# EAGLE design led_dual_supply_REV_2a (EAGLE 5.07)
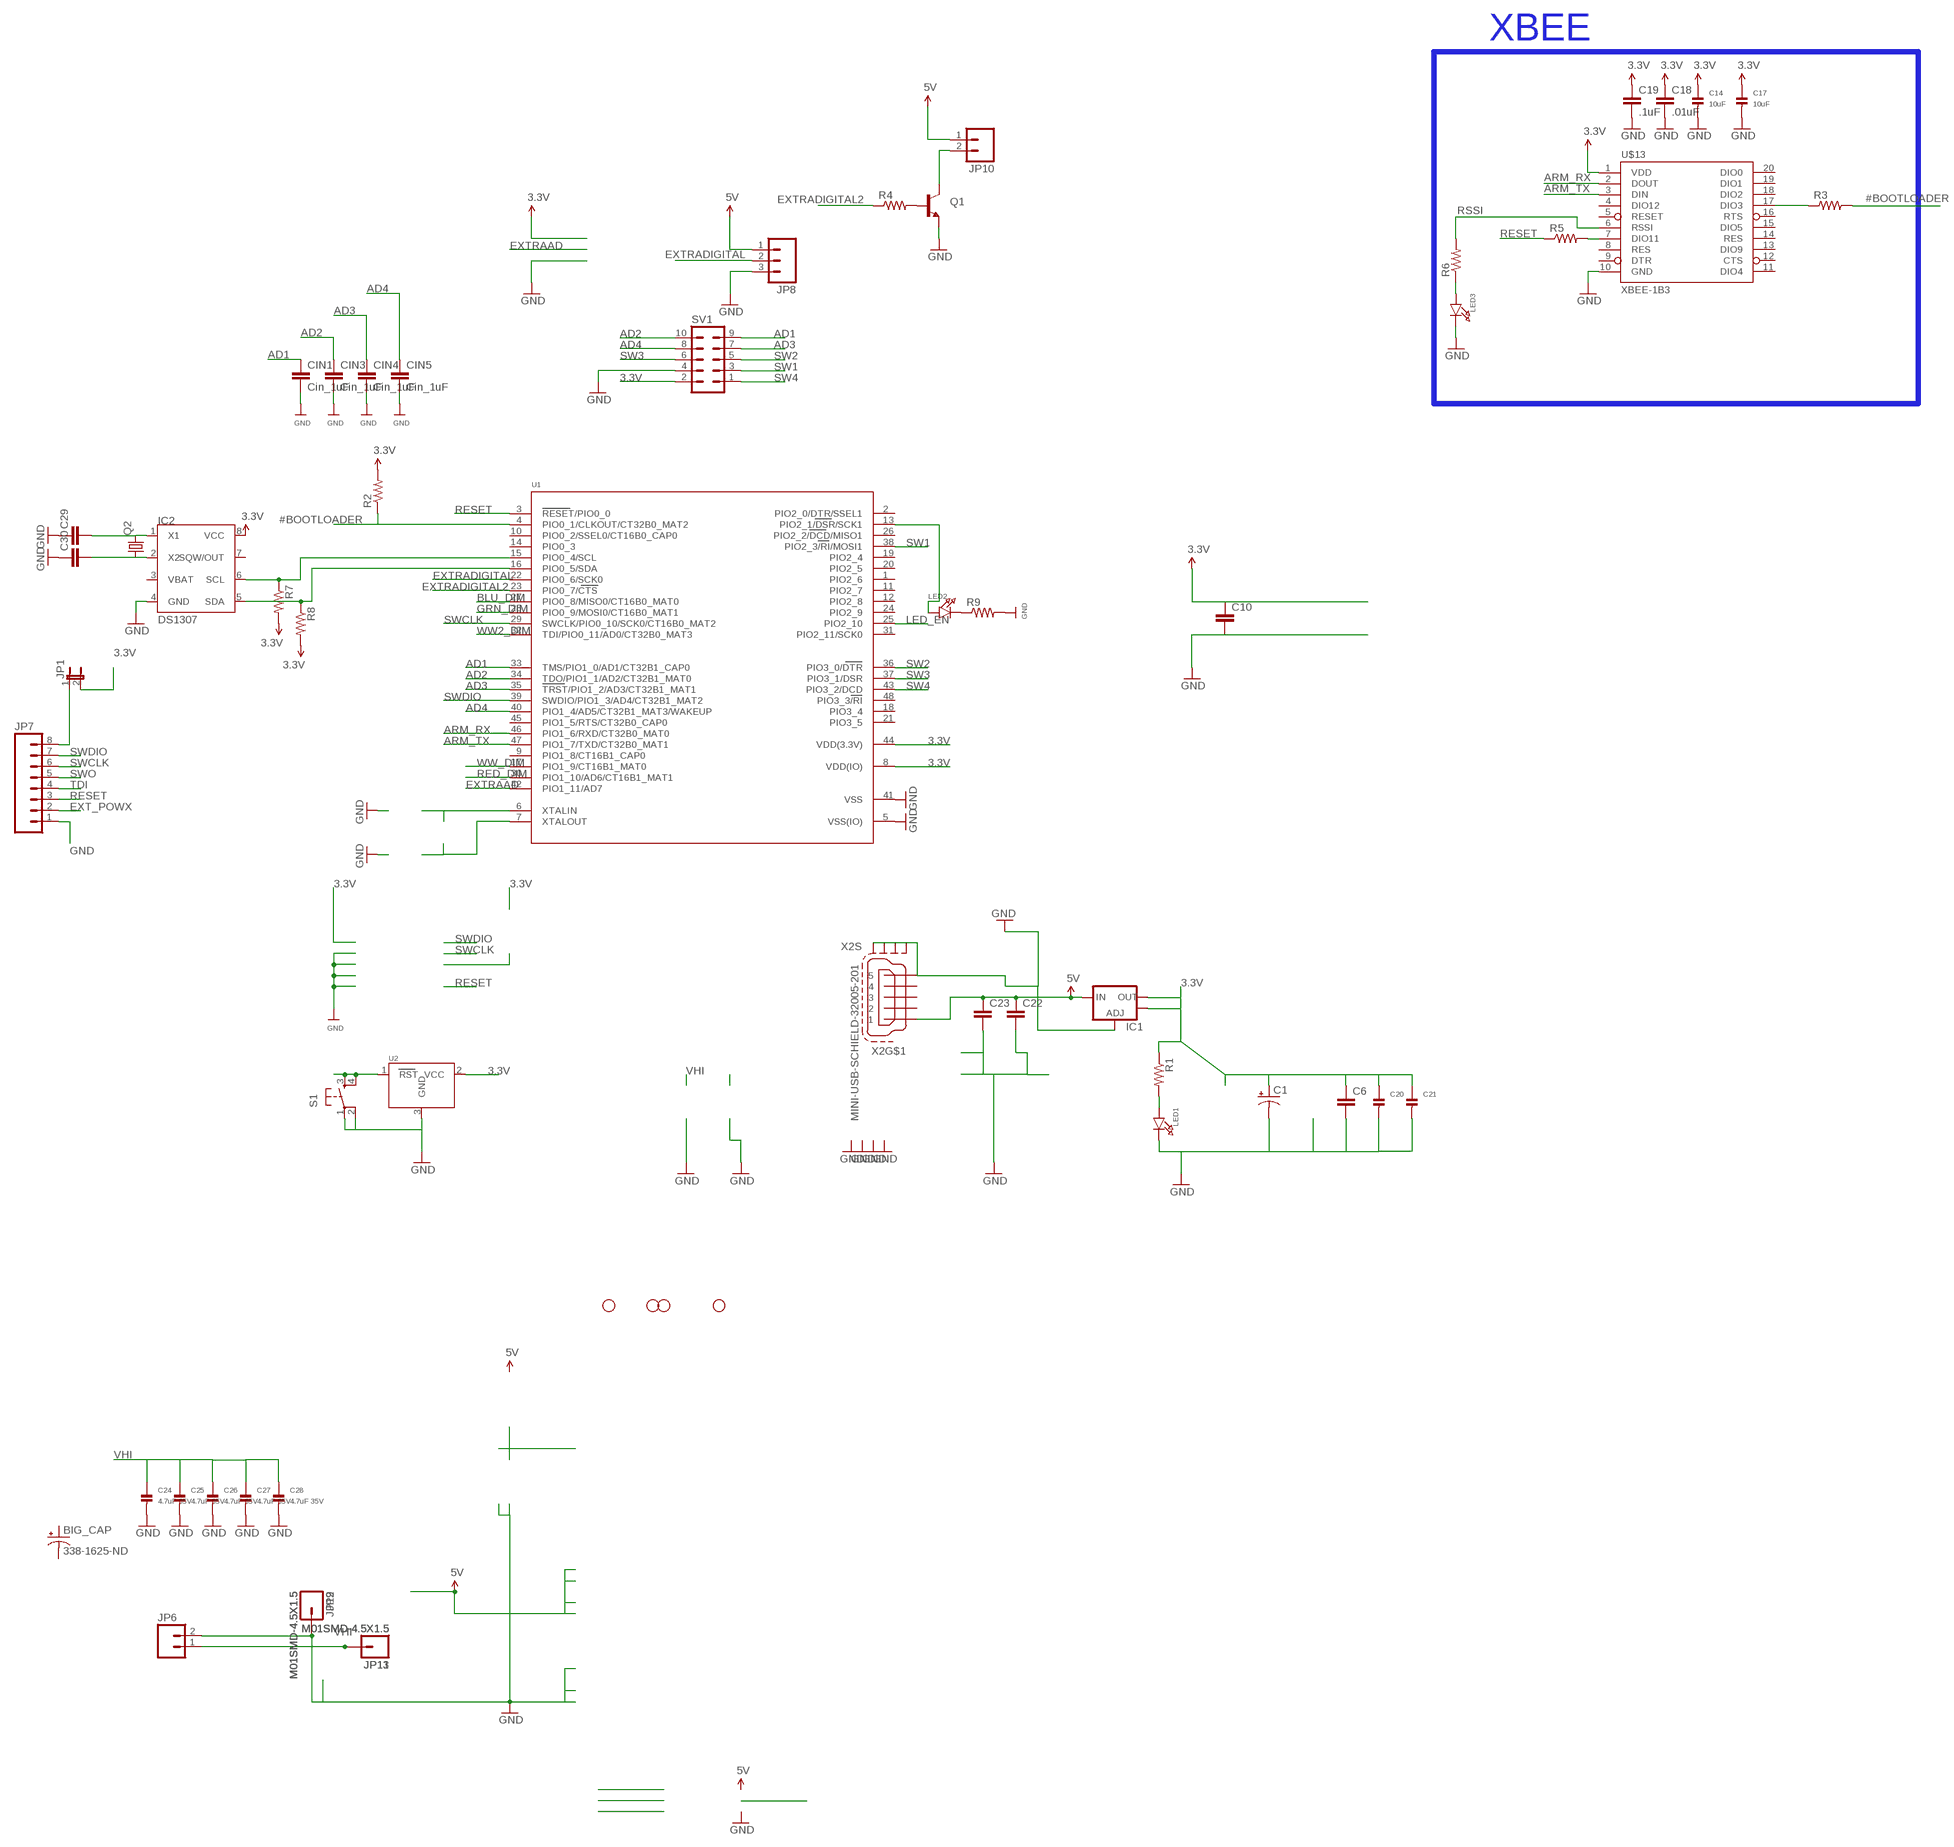
[diagram p0: schematic, sheet 1, part 1 of 2]
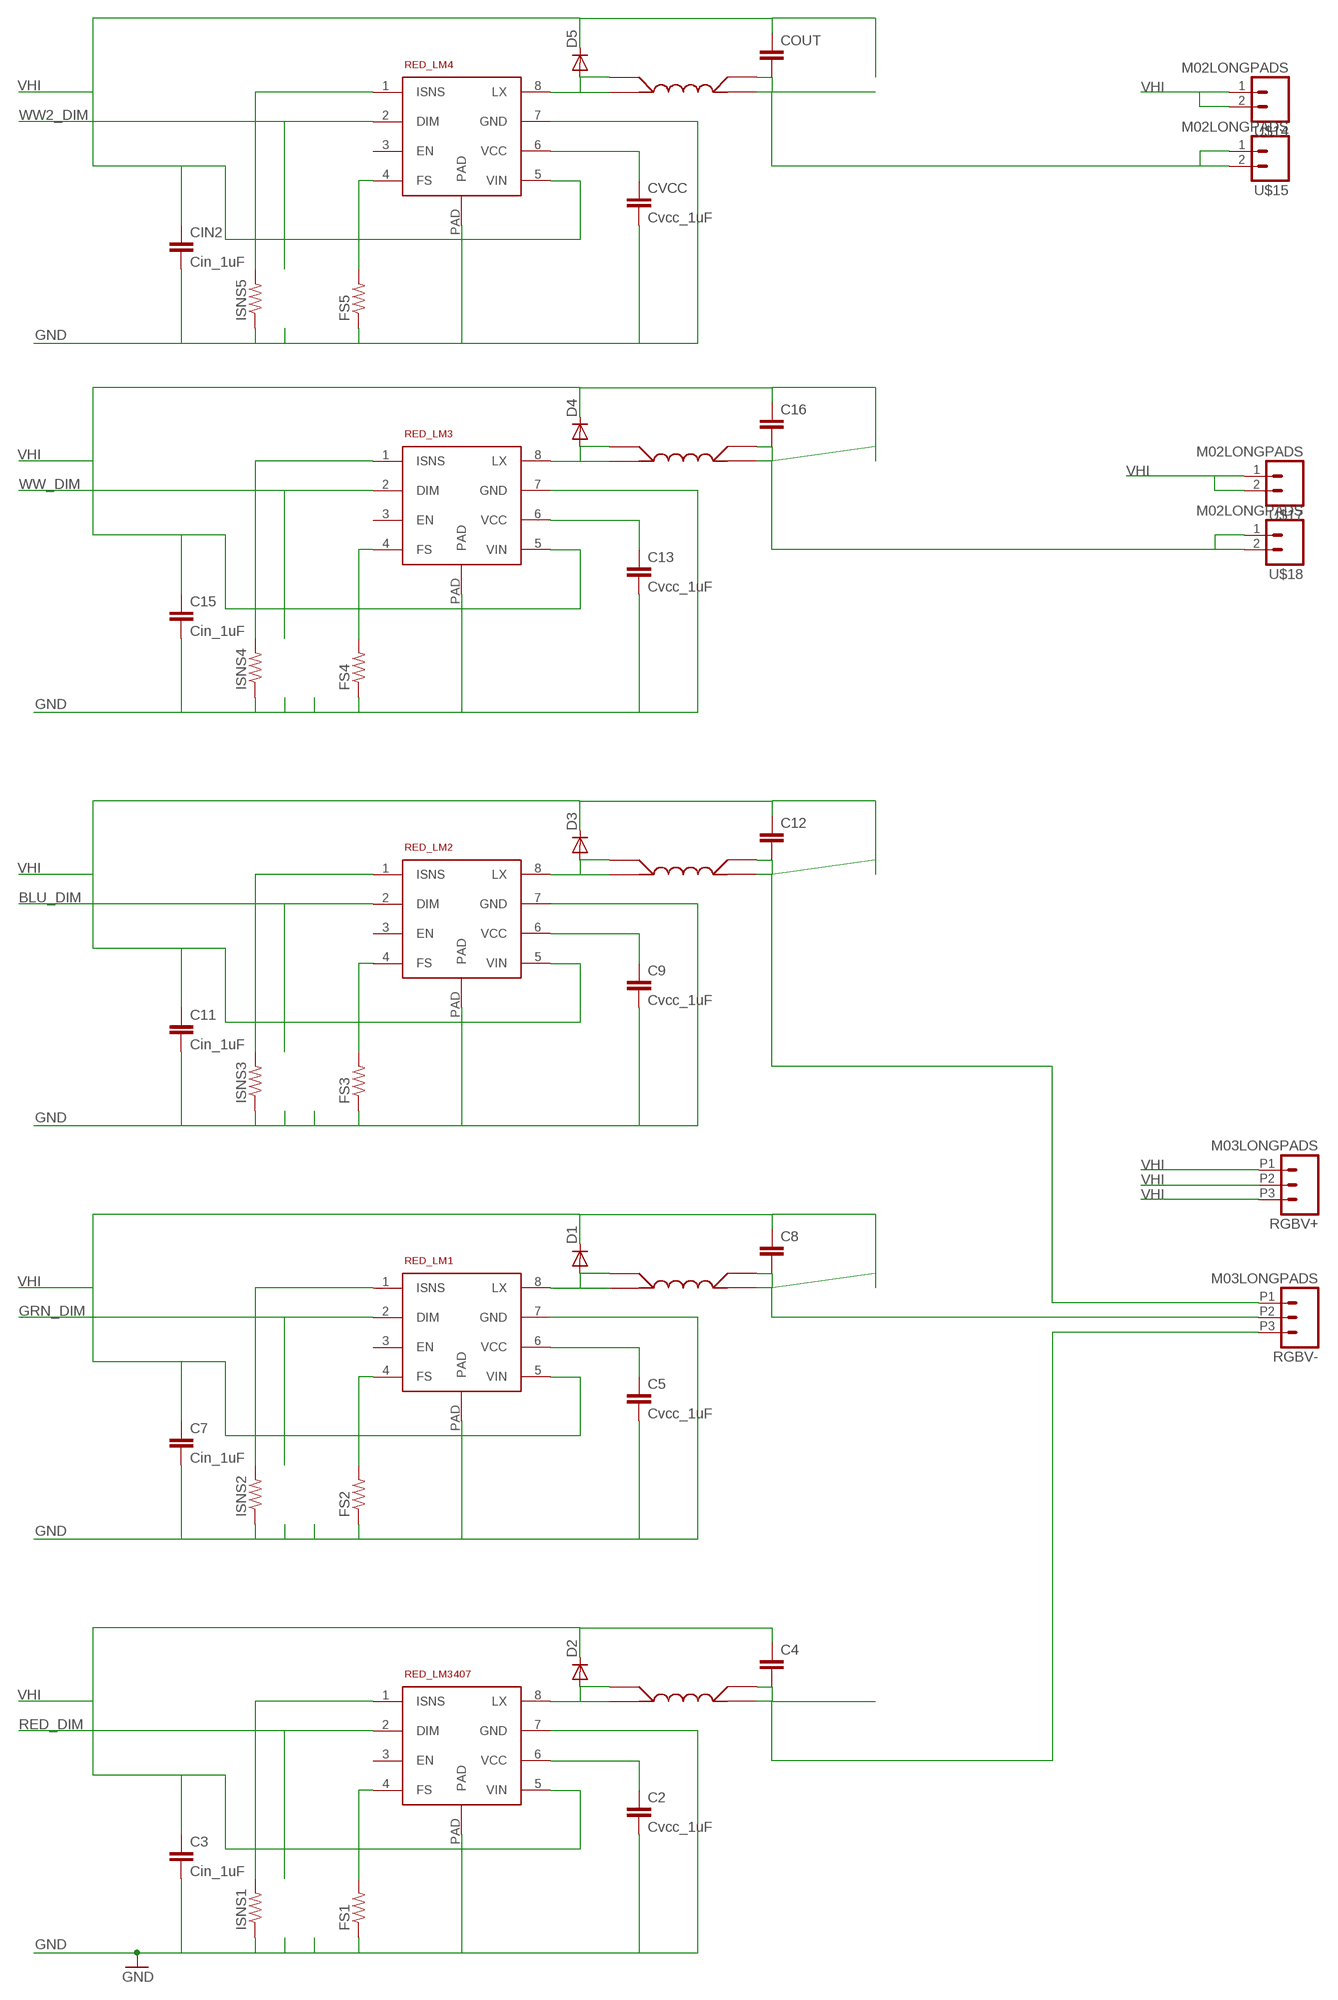
[diagram p1: schematic, sheet 1, part 2 of 2]

## Parts
BIG_CAP  338-1625-ND  CAP_POLG  [PANASONIC_G]
C1  CAP_POL3528  [EIA3528]
C2  Cvcc_1uF  C-EUC1206  [C1206]
C3  Cin_1uF  C-EUC1206  [C1206]
C4  C-EUC1206  [C1206]
C5  Cvcc_1uF  C-EUC1206  [C1206]
C6  CAP0805  [0805]
C7  Cin_1uF  C-EUC1206  [C1206]
C8  C-EUC1206  [C1206]
C9  Cvcc_1uF  C-EUC1206  [C1206]
C10  CAP0805  [0805]
C11  Cin_1uF  C-EUC1206  [C1206]
C12  C-EUC1206  [C1206]
C13  Cvcc_1uF  C-EUC1206  [C1206]
C14  10uF  CAP_CERAMIC1206  [1206]
C15  Cin_1uF  C-EUC1206  [C1206]
C16  C-EUC1206  [C1206]
C17  10uF  CAP_CERAMIC1206  [1206]
C18  .01uF  CAP0805  [0805]
C19  .1uF  CAP0805  [0805]
C20  CAP_CERAMIC1206  [1206]
C21  CAP_CERAMIC1206  [1206]
C22  CAP0805  [0805]
C23  CAP0805  [0805]
C24  4.7uF 35V  CAP_CERAMIC1206  [1206]
C25  4.7uF 35V  CAP_CERAMIC1206  [1206]
C26  4.7uF 35V  CAP_CERAMIC1206  [1206]
C27  4.7uF 35V  CAP_CERAMIC1206  [1206]
C28  4.7uF 35V  CAP_CERAMIC1206  [1206]
C29  CAP0805  [0805]
C30  CAP0805  [0805]
CIN1  Cin_1uF  CAP0805  [0805]
CIN2  Cin_1uF  C-EUC1206  [C1206]
CIN3  Cin_1uF  CAP0805  [0805]
CIN4  Cin_1uF  CAP0805  [0805]
CIN5  Cin_1uF  CAP0805  [0805]
COUT  C-EUC1206  [C1206]
CVCC  Cvcc_1uF  C-EUC1206  [C1206]
D1  DIODESMA  [SMA-DIODE]
D2  DIODESMA  [SMA-DIODE]
D3  DIODESMA  [SMA-DIODE]
D4  DIODESMA  [SMA-DIODE]
D5  DIODESMA  [SMA-DIODE]
FS1  RESISTOR  [0805]
FS2  RESISTOR  [0805]
FS3  RESISTOR  [0805]
FS4  RESISTOR  [0805]
FS5  RESISTOR  [0805]
IC1  V_REG_LM1117SOT223  [SOT223]
IC2  DS1307  [SOIC-8]
ISNS1  RESISTOR  [0805]
ISNS2  RESISTOR  [0805]
ISNS3  RESISTOR  [0805]
ISNS4  RESISTOR  [0805]
ISNS5  RESISTOR  [0805]
JP1  JUMPER-2SMD-NO  [SJ_2S-NO]
JP2  STAND-OFF  [STAND-OFF]
JP3  STAND-OFF  [STAND-OFF]
JP4  STAND-OFF  [STAND-OFF]
JP5  STAND-OFF  [STAND-OFF]
JP6  M02  [1X02_LONGPADS]
JP7  M08  [1X08]
JP8  M03LOCK_LONGPADS  [1X03_LOCK_LONGPADS]
JP9  M01SMD-4.5X1.5  [PAD-1.5X4.5]
JP10  M02LOCK  [1X02_LOCK]
JP11  M01SMD-4.5X1.5  [PAD-1.5X4.5]
JP12  M01SMD-4.5X1.5  [PAD-1.5X4.5]
JP13  M01SMD-4.5X1.5  [PAD-1.5X4.5]
LED1  LED0805  [CHIPLED_0805]
LED2  LED0805  [CHIPLED_0805]
LED3  LED0805  [CHIPLED_0805]
Q1  TRANSISTOR_NPNSOT23-3  [SOT23-3]
Q2  CRYSTAL32-SMD  [CRYSTAL-32KHZ-SMD]
R1  RESISTOR  [0805]
R2  RESISTOR  [0805]
R3  RESISTOR  [0805]
R4  RESISTOR  [0805]
R5  RESISTOR  [0805]
R6  RESISTOR  [0805]
R7  RESISTOR  [0805]
R8  RESISTOR  [0805]
R9  RESISTOR  [0805]
RED_LM1  LM3407  [LM3407]
RED_LM2  LM3407  [LM3407]
RED_LM3  LM3407  [LM3407]
RED_LM4  LM3407  [LM3407]
RED_LM3407  LM3407  [LM3407]
RGBV+  M03LONGPADS  [A19430-ELON]
RGBV-  M03LONGPADS  [A19430-ELON]
S1  TAC_SWITCHPTH  [TACTILE-PTH]
SV1  ML10  [ML10]
U1  LPC1113/4  [LQFP48]
U2  MCP130TREFLOW  [SOT23-R]
U$1  SRR4018  [SDR0805]
U$2  SRR4018  [SDR0805]
U$3  SRR4018  [SDR0805]
U$4  SRR4018  [SDR0805]
U$11  SRR4018  [SDR0805]
U$13  XBEE-1B3  [XBEE-SMD]
U$14  M02LONGPADS  [A19423-ELON]
U$15  M02LONGPADS  [A19423-ELON]
U$17  M02LONGPADS  [A19423-ELON]
U$18  M02LONGPADS  [A19423-ELON]
X2  MINI-USB-SCHIELD-32005-201  [32005-201]

## Nets
3.3V: C1.A(+) C6.1 C10.1 C14.1 C17.1 C18.1 C19.1 C20.1 C21.1 IC1.2(OUT) IC1.4(OUT) IC2.8(VCC) JP1.2 R1.1 R2.2 R7.2 R8.2 SV1.2 U1.8(VDD(IO)) U1.44(VDD(3.3V)) U2.2(VCC) U$13.1(VDD) ; supply symbol labelled 5V
5V: C22.1 C23.1 IC1.3(IN) JP8.1 JP10.1 X2.1
#BOOTLOADER: R2.1 R3.2 U1.4(PIO0_1/CLKOUT/CT32B0_MAT2)
AD1: CIN1.1 SV1.9 U1.33(TMS/PIO1_0/AD1/CT32B1_CAP0)
AD2: CIN3.1 SV1.10 U1.34(TDO/PIO1_1/AD2/CT32B1_MAT0)
AD3: CIN4.1 SV1.7 U1.35(TRST/PIO1_2/AD3/CT32B1_MAT1)
AD4: CIN5.1 SV1.8 U1.40(PIO1_4/AD5/CT32B1_MAT3/WAKEUP)
ARM_RX: U1.46(PIO1_6/RXD/CT32B0_MAT0) U$13.2(DOUT)
ARM_TX: U1.47(PIO1_7/TXD/CT32B0_MAT1) U$13.3(DIN)
BLU_DIM: RED_LM2.2(DIM) U1.27(PIO0_8/MISO0/CT16B0_MAT0)
DIO3: R3.1 U$13.17(DIO3)
DIO11: R5.2 U$13.7(DIO11)
EXT_POWX: JP7.2
EXTRAAD: U1.42(PIO1_11/AD7)
EXTRADIGITAL: JP8.2 U1.22(PIO0_6/SCK0)
EXTRADIGITAL2: R4.1 U1.23(PIO0_7/CTS)
GND: C1.C(-) C2.2 C3.2 C5.2 C6.2 C7.2 C9.2 C10.2 C11.2 C13.2 C14.2 C15.2 C17.2 C18.2 C19.2 C20.2 C21.2 C22.2 C23.2 C24.2 C25.2 C26.2 C27.2 C28.2 C29.1 C30.1 CIN1.2 CIN2.2 CIN3.2 CIN4.2 CIN5.2 CVCC.2 FS1.1 FS2.1 FS3.1 FS4.1 FS5.1 IC1.1(ADJ) IC2.4(GND) ISNS1.1 ISNS2.1 ISNS3.1 ISNS4.1 ISNS5.1 JP6.2 JP7.1 JP8.3 JP9.P$1 JP12.P$1 LED1.C LED3.C Q1.2(E) R9.2 RED_LM1.7(GND) RED_LM1.PAD RED_LM2.7(GND) RED_LM2.PAD RED_LM3.7(GND) RED_LM3.PAD RED_LM4.7(GND) RED_LM4.PAD RED_LM3407.7(GND) RED_LM3407.PAD S1.1 S1.2 SV1.4 U1.5(VSS(IO)) U1.41(VSS) U2.3(GND) U$13.10(GND) X2.5 X2.M1(S:S1) X2.M2(S:S2) X2.M3(S:S3) X2.M4(S:S4)
GRN_DIM: RED_LM1.2(DIM) U1.28(PIO0_9/MOSI0/CT16B0_MAT1)
LED_EN: U1.25(PIO2_10)
N$1: C5.1 RED_LM1.6(VCC)
N$2: FS2.2 RED_LM1.4(FS)
N$3: C2.1 RED_LM3407.6(VCC)
N$4: ISNS2.2 RED_LM1.1(ISNS)
N$5: FS1.2 RED_LM3407.4(FS)
N$6: ISNS1.2 RED_LM3407.1(ISNS)
N$7: D2.A RED_LM3407.8(LX) U$2.1A U$2.1B
N$8: D1.A RED_LM1.8(LX) U$1.1A U$1.1B
N$9: IC2.6(SCL) R7.1 U1.15(PIO0_4/SCL)
N$10: C8.2 RGBV-.P2 U$1.2A U$1.2B
N$11: C9.1 RED_LM2.6(VCC)
N$12: FS3.2 RED_LM2.4(FS)
N$13: ISNS3.2 RED_LM2.1(ISNS)
N$14: D3.A RED_LM2.8(LX) U$3.1A U$3.1B
N$15: C12.2 RGBV-.P1 U$3.2A U$3.2B
N$16: C13.1 RED_LM3.6(VCC)
N$17: FS4.2 RED_LM3.4(FS)
N$18: ISNS4.2 RED_LM3.1(ISNS)
N$19: D4.A RED_LM3.8(LX) U$4.1A U$4.1B
N$20: C16.2 U$4.2A U$4.2B U$18.1 U$18.2
N$21: JP1.1 JP7.8
N$23: LED2.A U1.13(PIO2_1/DSR/SCK1)
N$24: LED2.C R9.1
N$25: IC2.5(SDA) R8.1 U1.16(PIO0_5/SDA)
N$26: CVCC.1 RED_LM4.6(VCC)
N$27: FS5.2 RED_LM4.4(FS)
N$28: ISNS5.2 RED_LM4.1(ISNS)
N$29: D5.A RED_LM4.8(LX) U$11.1A U$11.1B
N$30: C29.2 IC2.1(X1) Q2.X2
N$31: Q1.1(B) R4.2
N$32: C30.2 IC2.2(X2) Q2.X1
N$36: C4.2 RGBV-.P3 U$2.2A U$2.2B
N$37: U1.7(XTALOUT)
N$38: U1.6(XTALIN)
N$64: JP10.2 Q1.3(C)
N$322: COUT.2 U$11.2A U$11.2B U$15.1 U$15.2
PWR_LED_R: LED1.A R1.2
RED_DIM: RED_LM3407.2(DIM) U1.30(PIO1_10/AD6/CT16B1_MAT1)
RESET: JP7.3 R5.1 S1.3 S1.4 U1.3(RESET/PIO0_0) U2.1(RST)
RSSI: R6.2 U$13.6(RSSI)
RSSI_R: LED3.A R6.1
SW1: SV1.3 U1.38(PIO2_3/RI/MOSI1)
SW2: SV1.5 U1.36(PIO3_0/DTR)
SW3: SV1.6 U1.37(PIO3_1/DSR)
SW4: SV1.1 U1.43(PIO3_2/DCD)
SWCLK: JP7.6 U1.29(SWCLK/PIO0_10/SCK0/CT16B0_MAT2)
SWDIO: JP7.7 U1.39(SWDIO/PIO1_3/AD4/CT32B1_MAT2)
SWO: JP7.5
TDI: JP7.4
VHI: C3.1 C4.1 C7.1 C8.1 C11.1 C12.1 C15.1 C16.1 C24.1 C25.1 C26.1 C27.1 C28.1 CIN2.1 COUT.1 D1.C D2.C D3.C D4.C D5.C JP6.1 JP11.P$1 JP13.P$1 RED_LM1.5(VIN) RED_LM2.5(VIN) RED_LM3.5(VIN) RED_LM4.5(VIN) RED_LM3407.5(VIN) RGBV+.P1 RGBV+.P2 RGBV+.P3 U$14.1 U$14.2 U$17.1 U$17.2
WW2_DIM: RED_LM4.2(DIM) U1.32(TDI/PIO0_11/AD0/CT32B0_MAT3)
WW_DIM: RED_LM3.2(DIM) U1.17(PIO1_9/CT16B1_MAT0)
Unconnected: BIG_CAP.+ BIG_CAP.- IC2.7(SQW/OUT) RED_LM1.3(EN) RED_LM2.3(EN) RED_LM3.3(EN) RED_LM4.3(EN) RED_LM3407.3(EN) U1.1(PIO2_6) U1.2(PIO2_0/DTR/SSEL1) U1.9(PIO1_8/CT16B1_CAP0) U1.10(PIO0_2/SSEL0/CT16B0_CAP0) U1.11(PIO2_7) U1.12(PIO2_8) U1.14(PIO0_3) U1.18(PIO3_4) U1.19(PIO2_4) U1.20(PIO2_5) U1.21(PIO3_5) U1.24(PIO2_9) U1.26(PIO2_2/DCD/MISO1) U1.31(PIO2_11/SCK0) U1.45(PIO1_5/RTS/CT32B0_CAP0) U1.48(PIO3_3/RI) U$13.4(DIO12) U$13.5(RESET) U$13.8(RES) U$13.9(DTR) U$13.11(DIO4) U$13.12(CTS) U$13.13(DIO9) U$13.14(RES) U$13.15(DIO5) U$13.16(RTS) U$13.18(DIO2) U$13.19(DIO1) U$13.20(DIO0) X2.2 X2.3 X2.4

## Notes on the sheet
- XBEE

## Power pins joined to a net without a drawn wire
VBAT: IC2.3(VBAT)

## Library data of the parts
BIG_CAP C1 = SparkFun:CAP_POL: Capacitor Polarized These are standard SMD and PTH capacitors. Normally 10uF, 47uF, and 100uF in electrolytic and tantalum varieties. Always verify the external diameter of the through hole cap, it varies with capacity, voltage, and manufacturer. The EIA devices should be standard.
C2 C3 C5 C7 C9 C11 C13 C15 CIN2 CVCC = resistor:C-EU: CAPACITOR, European symbol
C4 C8 C12 C16 COUT = rcl:C-EU: CAPACITOR, European symbol
C6 C10 C18 C19 C22 C23 C29 C30 CIN1 CIN3-CIN5 = SparkFun:CAP: Capacitor Standard 0603 ceramic capacitor, and 0.1" leaded capacitor.
C14 C17 C20 C21 C24-C28 = microbuilder:CAP_CERAMIC: Ceramic Capacitors 0603 - 0603 Surface Mount Capacitors 3pF 250V +/-0.1pF RF Ceramic Capacitor[Digikey: 712-1347-1-ND] 16 pF 50V 5% Ceramic Capacitor[Digikey: 445-5051-2-ND] 22 pF 50V Ceramic Capacitor [Digikey: PCC220ACVTR-ND] 33 pF 50V 5% Ceramic Capacitor 680 pF 50V Ceramic Capacitor 0.1 µF 25V 10% Ceramic Capacitor [Digikey: PCC2277TR-ND] 1.0 µF 25V 10% Ceramic Capacitor [Digikey: 445-5146-2-ND] 0805 - 0805 Surface Mount Capacitors 0.1 µF 25V 10% Ceramic Capacitor [Digikey: PCC1828TR-ND] 1.0 µF 16V 10% Ceramic Capacitor[Digikey: 490-1691-2-ND] 10.0 µF 10V 10% Ceramic Capacitor[Digikey: 709-1228-1-ND] 1206 - 1206 Surface Mount Capacitors
D1-D5 = SparkFun:DIODE: Diode These are standard reverse protection diodes and small signal diodes. SMA package can handle up to about 1A. SOD-323 can handle about 200mA. What the SOD-323 package when ordering, there are some mfgs out there that are 5-pin packages.
FS1-FS5 ISNS1-ISNS5 R1-R9 = SparkFun:RESISTOR: Resistor Basic schematic elements and footprints for 0603, 1206, and PTH 1/10th watt (small) resistors.
IC1 = SparkFun:V_REG_LM1117: Voltage Regulator LM1117 Standard adjustable voltage regulator but in SMD form. Spark Fun Electronics SKU : COM-00595
IC2 = dallas:DS1307: I2C Serial RTC w/56 bytes battery backed RAM
JP1 = SparkFun:JUMPER-2: Jumper Basic 0.1" spaced jumper. Use with breakaway headers.
JP2-JP5 = SparkFun:STAND-OFF: Stand Off This is the mechanical footprint for a #4 phillips button head screw. Use the keepout ring to avoid running the screw head into surrounding components. SKU : PRT-00447
JP6 JP10 = SparkFun:M02: Header 2 Standard 2-pin 0.1" header. Use with straight break away headers (SKU : PRT-00116), right angle break away headers (PRT-00553), swiss pins (PRT-00743), machine pins (PRT-00117), and female headers (PRT-00115). Molex polarized connector foot print use with SKU : PRT-08233 with associated crimp pins and housings.
JP7 = SparkFun:M08: Header 8 Standard 8-pin 0.1" header. Use with straight break away headers (SKU : PRT-00116), right angle break away headers (PRT-00553), swiss pins (PRT-00743), machine pins (PRT-00117), and female headers (PRT-00115).
JP8 = SparkFun:M03: Header 3 Standard 3-pin 0.1" header. Use with straight break away headers (SKU : PRT-00116), right angle break away headers (PRT-00553), swiss pins (PRT-00743), machine pins (PRT-00117), and female headers (PRT-00115). Molex polarized connector foot print use with SKU : PRT-08232 with associated crimp pins and housings.
JP9 JP11-JP13 = SparkFun:M01: Header 1 Standard 1-pin 0.1" header. Use with straight break away headers (SKU : PRT-00116), right angle break away headers (PRT-00553), swiss pins (PRT-00743), machine pins (PRT-00117), and female headers (PRT-00115).
LED1-LED3 = microbuilder:LED: LED 0603 - 0603 Surface Mount Package Green LED - Low Power (3.9mcd, 2ma, 1.7Vf) Orange LED - Low Power (9.8mcd, 2ma, 1.8Vf) Red LED - Low Power (5mcd, 2ma, 1.8Vf) Yellow LED - Low Power (7mcd, 2ma, 1.8Vf) 0805 - 0805 Surface Mount Package Red LED (104mcd, 20mA, Diffused) - LS R976 [Digikey: 475-1278-6-ND] Red LED (12mcd, 20mA, 2.0Vf, Clear) - APT2012EC [Digikey: 754-1128-1-ND] Green LED (15mcd, 20mA, 2.2Vf, Clear) - APT2012GC [Digikey: 754-1131-1-ND] White LED (160mcd, 20mA, 2.1Vf, Clear) - APT2012SECK [Digikey: 754-1130-1-ND] 1206 - 1206 Surface Mount Package Green LED (26mcd, 20mA, Diffused) - LG N971 [Digikey: 475-1407-6-ND] Red LED (15mcd, 20mA, Diffused) - LH N974 [Digikey: 475-1416-6-ND]
Q1 = SparkFun:TRANSISTOR_NPN: Transistor NPN BJT configuration in SOT23 package. MMBT2222 is the common NPN we use. Double check BCE configuration again layout.
Q2 = SparkFun:CRYSTAL: Crystals Various standard crystals. Proven footprints. Spark Fun Electronics SKU : COM-00534
RED_LM1-RED_LM4 RED_LM3407 = JoesCustom:LM3407
RGBV+ RGBV- = _Part Repository:M03: 3-pin headers
S1 = SparkFun:TAC_SWITCH: Momentary Switch Button commonly used for reset or general input. Spark Fun Electronics SKU : COM-00097
SV1 = con-harting-ml:ML10: HARTING
U1 = microbuilder:LPC1113/4: LPC1113/4 MCU QFP48 Package ARM Cortex M0, 50MHz Operation, 8 Channel 10-Bit ADC, 1²C, 2xSPI, UART, 2x16 Bit and 2x32 Bit Timers, Internal 12MHz Oscillator, 1.8-3.6V operation. Model Flash SRAM Part N°: Digikey # LPC1113 24KB 8KB LPC1113FBD48/301 TBD LPC1114 32KB 8KB LPC1114FBD48/301 TBD
U2 = microbuilder:MCP130T: MCP130T Voltage Supervisor (Active Low) Voltage supervisors will put the MCU in a reset state if the voltage drops below a pre-determined level. SOT23-R/SOT23-W: Voltage Supervisor - 3.15V Active Low Note: Use the "Reflow" footprint when working with solder paste, and the "Wave" footprint when soldering by hand with a soldering iron (the latter has larger pads that are easier to solder by hand). Digikey: MCP130T-315I/TTCT-ND
U$1-U$4 U$11 = JoesCustom:SRR4018
U$13 = SparkFun:XBEE-1
U$14 U$15 U$17 U$18 = _Part Repository:M02: 2-Position Headers
X2 = con-cypressindustries:MINI-USB-SCHIELD-: MINI USB-B Conector Source: www.cypressindustries.com

## Board
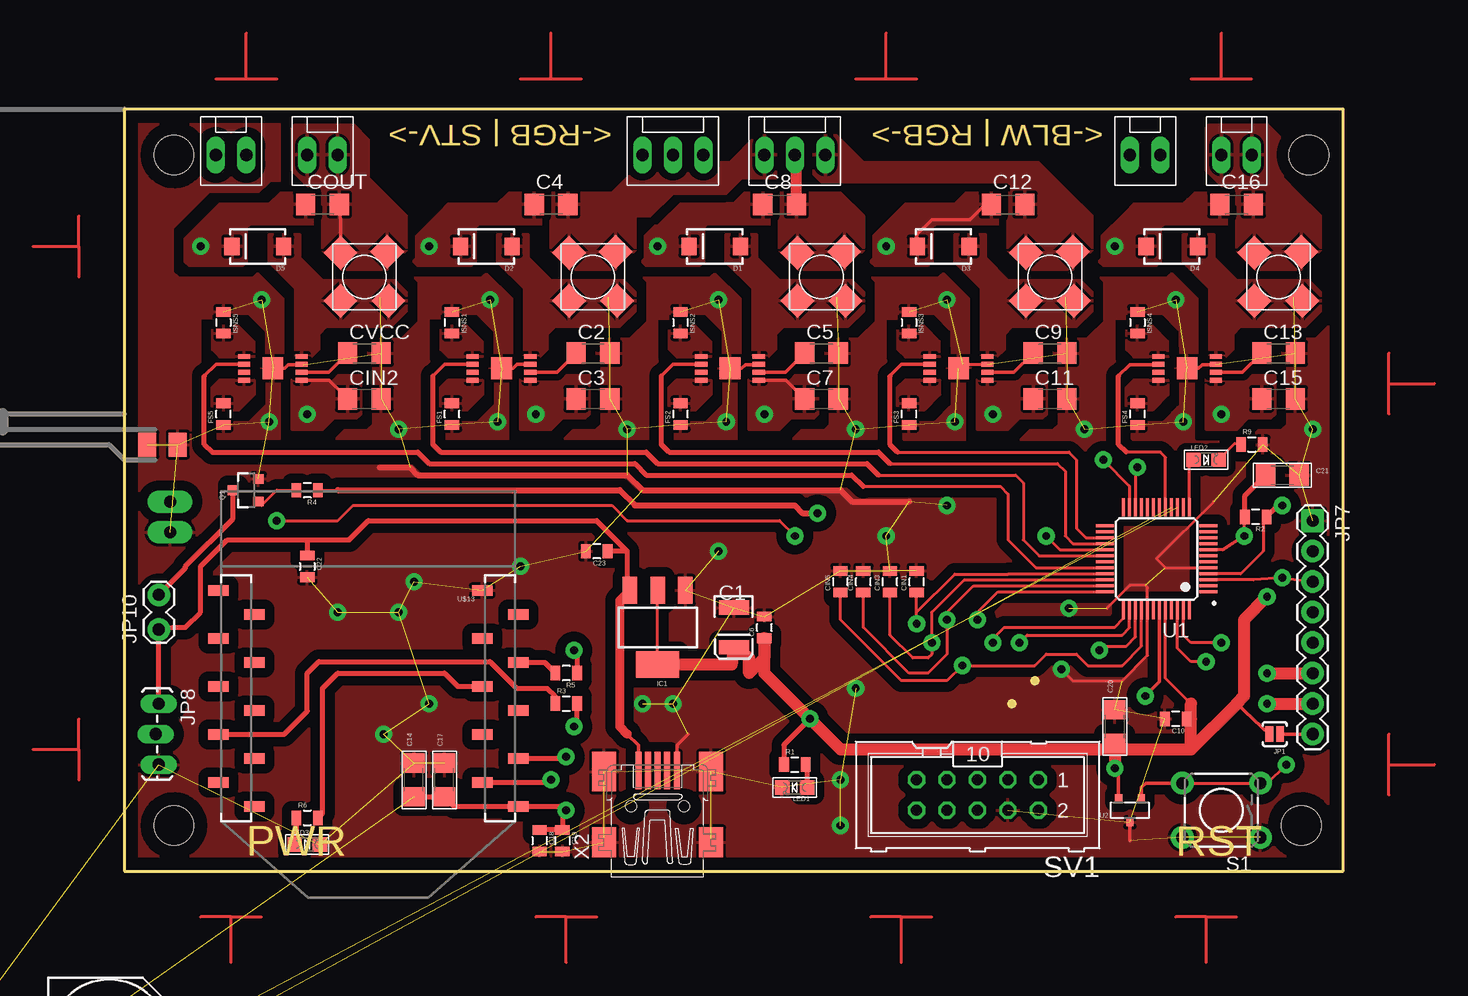
[diagram p2: board, top side]
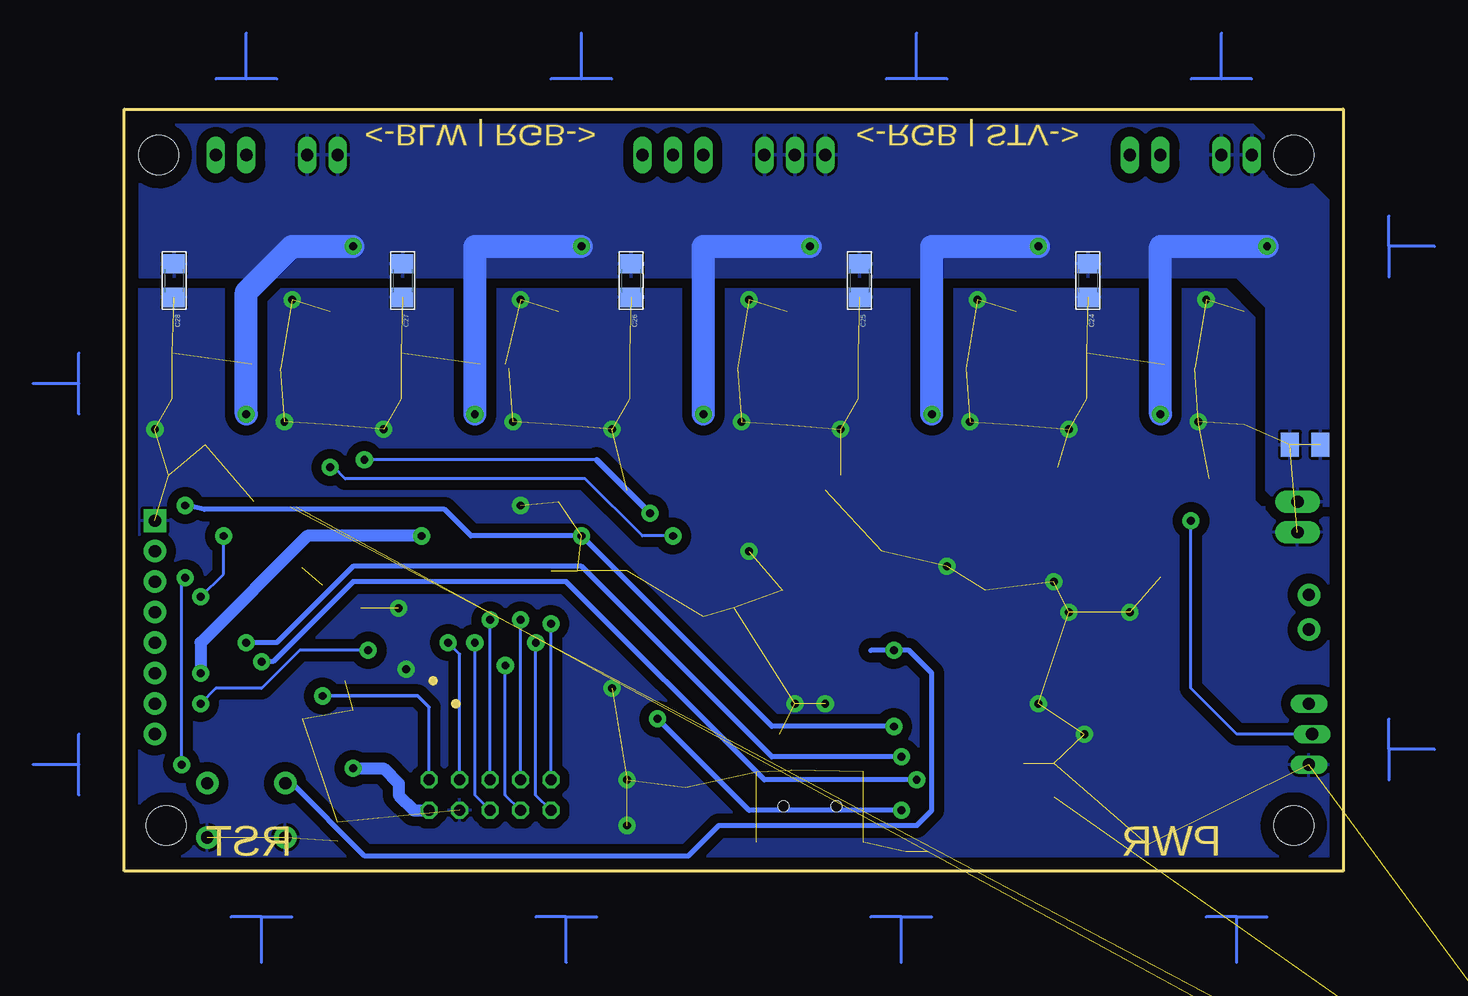
[diagram p3: board, bottom side, seen from below]

Size 101.6 x 63.5 mm. Coordinates in mm from the lower left corner, seen from the top.
Outline: 0,0 101.6,0 101.6,63.5 0,63.5 0,0
Copper layers (1*16): Top 0.035mm / dielectric 1.5mm / Bottom 0.035mm
Design rules "default *": minimum track width 9mil, minimum drill 24mil, track to track 9mil, track to pad 9mil, pad to pad 8mil, via to via 10mil, smd to smd 10mil, copper to edge 40mil, drill to drill 8mil, minimum pad ring 10mil, minimum via ring 8mil, stop-mask expansion 4mil, vias tented up to drill 0mil, thermal gap 10mil
bRestrict: 1 lines
Milling: area 75.7,15.7 to 76.1,16.1; area 73.8,13.8 to 74.2,14.1

### Footprints (pad centres in the part's own frame; a part is rotated, then mirrored left to right if it is on the bottom)
PANASONIC_G = smd 3.9 x 1.6: + 4.25,0; - -4.25,0
EIA3528 = smd 1.2 x 2.5: A 1.65,0; C -1.65,0
C1206 = smd 1.6 x 1.8: 1 -1.4,0; 2 1.4,0
0805 = smd 0.8 x 1.2: 1 -0.9,0; 2 0.9,0
1206 = smd 1.6 x 1.8: 1 -1.4,0; 2 1.4,0
SMA-DIODE = smd 1.27 x 1.47: A -2.15,0; C 2.15,0
SOT223 = smd 1.219 x 2.235: 1 -2.311,-3.099; 2 0,-3.099; 3 2.311,-3.099 | smd 3.6 x 2.2: 4 0,3.099
SOIC-8 = smd 2.032 x 0.66: 1 -3.073,1.27; 2 -3.073,0; 3 -3.073,-1.27; 4 -3.073,-2.54; 5 3.073,-2.54; 6 3.073,-1.27; 7 3.073,0; 8 3.073,1.27
SJ_2S-NO = smd 0.635 x 1.27: 1 -0.45,0; 2 0.45,0
STAND-OFF = hole 3.302: 0,0
1X02_LONGPADS = drill 1.016 pad 1.88 long: 1 0,0; 2 2.54,0
1X08 = drill 1.016 pad 1.88 square: 1 0,0 | drill 1.016 pad 1.88 round: 2 2.54,0; 3 5.08,0; 4 7.62,0; 5 10.16,0; 6 12.7,0; 7 15.24,0; 8 17.78,0
1X03_LOCK_LONGPADS = drill 1.016 long: 1 0,0; 2 2.54,-0.254; 3 5.08,0
PAD-1.5X4.5 = smd 1.5 x 2: P$1 0,0
1X02_LOCK = drill 1.016 pad 1.88 round: 1 -0.178,0; 2 2.718,0
CHIPLED_0805 = smd 1.2 x 1.2: A 0,-1.05; C 0,1.05
SOT23-3 = smd 0.8 x 0.9: 1 -0.95,-1; 2 0.95,-1; 3 0,1.1
CRYSTAL-32KHZ-SMD = smd 2.5 x 6: SHEILD 0,5.08 | smd 1 x 2.5: X1 -1.27,0; X2 1.27,0
LM3407 = smd 0.406 x 1.016: 1 -0.991,-2.4; 2 -0.33,-2.4; 3 0.33,-2.4; 4 0.991,-2.4; 5 0.991,2.4; 6 0.33,2.4; 7 -0.33,2.4; 8 -0.991,2.4 | smd 1.854 x 1.727: PAD 0,0
A19430-ELON = drill 1.02 long: P1 2.54,0; P2 0,0; P3 -2.54,0
TACTILE-PTH = drill 1.016 pad 1.88 round: 1 -3.251,2.261; 2 3.251,2.261; 3 -3.251,-2.261; 4 3.251,-2.261
ML10 = drill 0.914 octagon: 1 -5.08,-1.27; 2 -5.08,1.27; 3 -2.54,-1.27; 4 -2.54,1.27; 5 0,-1.27; 6 0,1.27; 7 2.54,-1.27; 8 2.54,1.27; 9 5.08,-1.27; 10 5.08,1.27
LQFP48 = smd 1.5 x 0.25: 1 -4.3,2.75; 2 -4.3,2.25; 3 -4.3,1.75; 4 -4.3,1.25; 5 -4.3,0.75; 6 -4.3,0.25; 7 -4.3,-0.25; 8 -4.3,-0.75; 9 -4.3,-1.25; 10 -4.3,-1.75; 11 -4.3,-2.25; 12 -4.3,-2.75; 25 4.3,-2.75; 26 4.3,-2.25; 27 4.3,-1.75; 28 4.3,-1.25; 29 4.3,-0.75; 30 4.3,-0.25; 31 4.3,0.25; 32 4.3,0.75; 33 4.3,1.25; 34 4.3,1.75; 35 4.3,2.25; 36 4.3,2.75 | smd 0.25 x 1.5: 13 -2.75,-4.3; 14 -2.25,-4.3; 15 -1.75,-4.3; 16 -1.25,-4.3; 17 -0.75,-4.3; 18 -0.25,-4.3; 19 0.25,-4.3; 20 0.75,-4.3; 21 1.25,-4.3; 22 1.75,-4.3; 23 2.25,-4.3; 24 2.75,-4.3; 37 2.75,4.3; 38 2.25,4.3; 39 1.75,4.3; 40 1.25,4.3; 41 0.75,4.3; 42 0.25,4.3; 43 -0.25,4.3; 44 -0.75,4.3; 45 -1.25,4.3; 46 -1.75,4.3; 47 -2.25,4.3; 48 -2.75,4.3
SOT23-R = smd 0.6 x 0.7: 1 -0.95,-1; 2 0.95,-1; 3 0,1
SDR0805 = smd 2 x 2 rotated 45: 1A -2,2; 1B 2,2; 2A -1.9,-2.1; 2B 2,-2
XBEE-SMD = smd 1.7 x 0.85: 1 -12.5,20; 2 -9.5,18; 3 -12.5,16; 4 -9.5,14; 5 -12.5,12; 6 -9.5,10; 7 -12.5,8; 8 -9.5,6; 9 -12.5,4; 10 -9.5,2; 11 12.5,2; 12 9.5,4; 13 12.5,6; 14 9.5,8; 15 12.5,10; 16 9.5,12; 17 12.5,14; 18 9.5,16; 19 12.5,18; 20 9.5,20
A19423-ELON = drill 1.02 long: 1 1.27,0; 2 -1.27,0
32005-201 = smd 3.1 x 0.5: 1 3,1.6; 2 3,0.8; 3 3,0; 4 3,-0.8; 5 3,-1.6 | smd 2.5 x 2: M1 -3,-4.45; M2 -3,4.45 | smd 3.3 x 2: M3 2.9,4.45; M4 2.9,-4.45 | hole 0.9: 0,2.2; 0,-2.2

### Placement (x,y rotation side)
BIG_CAP  -1.27,-13.97 0 top  (outside the outline)
C1  50.8,20.32 270 top
C2  39.05,43.18 0 top
C3  39.05,39.37 0 top
C4  35.56,55.56 0 top
C5  58.1,43.18 0 top
C6  53.34,20.32 90 top
C7  58.1,39.37 0 top
C8  54.61,55.56 0 top
C9  77.15,43.18 0 top
C10  87.63,12.7 180 top
C11  77.15,39.37 0 top
C12  73.66,55.56 0 top
C13  96.2,43.18 0 top
C14  24.13,7.62 90 top
C15  96.2,39.37 0 top
C16  92.71,55.56 0 top
C17  26.67,7.62 90 top
C18  34.61,2.54 270 top
C19  36.51,2.54 270 top
C20  82.55,12.06 90 top
C21  96.52,33.02 0 top
C22  15.24,25.4 270 top
C23  39.37,26.67 180 top
C24  21.27,49.21 270 bottom
C25  40.32,49.21 270 bottom
C26  59.37,49.21 270 bottom
C27  78.42,49.21 270 bottom
C28  97.47,49.21 270 bottom
C29  -27.94,-31.75 0 top  (outside the outline)
C30  -27.94,-35.56 0 top  (outside the outline)
CIN1  66.04,24.13 90 top
CIN2  20,39.37 0 top
CIN3  63.82,24.13 90 top
CIN4  61.59,24.13 90 top
CIN5  59.69,24.13 90 top
COUT  16.51,55.56 0 top
CVCC  20,43.18 0 top
D1  49.21,52.07 180 top
D2  30.16,52.07 180 top
D3  68.26,52.07 180 top
D4  87.31,52.07 180 top
D5  11.11,52.07 180 top
FS1  27.3,38.1 90 top
FS2  46.35,38.1 90 top
FS3  65.41,38.1 90 top
FS4  84.45,38.1 90 top
FS5  8.26,38.1 90 top
IC1  44.45,20.32 180 top
IC2  -20.32,-24.13 0 top  (outside the outline)
ISNS1  27.3,45.72 270 top
ISNS2  46.35,45.72 270 top
ISNS3  65.41,45.72 270 top
ISNS4  84.45,45.72 270 top
ISNS5  8.26,45.72 270 top
JP1  95.89,11.43 180 top
JP2  98.11,3.81 0 bottom
JP3  4.13,59.69 0 bottom
JP4  4.13,3.81 0 bottom
JP5  98.74,59.69 0 top
JP6  3.81,30.8 270 bottom
JP7  99.06,29.21 270 top
JP8  2.86,13.97 270 top
JP9  1.91,35.56 0 top
JP10  2.86,20.32 90 top
JP11  4.45,35.56 0 bottom
JP12  4.45,35.56 0 top
JP13  1.91,35.56 0 bottom
LED1  55.88,6.99 90 top
LED2  90.17,34.29 270 top
LED3  15.24,2.22 270 top
Q1  10.16,31.75 90 top
Q2  -27.94,-26.67 0 top  (outside the outline)
R1  55.88,8.89 0 top
R2  94.3,29.53 180 top
R3  36.83,13.97 0 top
R4  15.24,31.75 180 top
R5  36.83,16.51 180 top
R6  15.24,4.45 0 top
R7  -27.94,-39.37 0 top  (outside the outline)
R8  -27.94,-43.18 0 top  (outside the outline)
R9  93.98,35.56 0 top
RED_LM1  50.48,41.91 270 top
RED_LM2  69.53,41.91 270 top
RED_LM3  88.58,41.91 270 top
RED_LM4  12.38,41.91 270 top
RED_LM3407  31.43,41.91 270 top
RGBV+  45.72,59.69 0 top
RGBV-  55.88,59.69 0 top
S1  91.44,5.08 180 top
SV1  71.12,6.35 180 top
U1  86.04,26.04 180 top
U2  83.82,5.08 180 top
U$1  58.1,49.53 180 top
U$2  39.05,49.53 180 top
U$3  77.15,49.53 180 top
U$4  96.2,49.53 180 top
U$11  20,49.53 180 top
U$13  20.32,25.4 180 top
U$14  8.89,59.69 0 top
U$15  16.51,59.69 0 top
U$17  85.09,59.69 0 top
U$18  92.71,59.69 0 top
X2  44.45,5.4 90 top

### Tracks (layer width: path | path; a pad name or v marks a point on that pad's centre or on a via)
3.3V  (via drill 0.66 pad 1.42)  (3 unrouted)
  Top 0.254: IC1.4 IC1.2 | U1.44 86.79,16.08 88.9,13.97 | 88.9,12.7 C10.1 | U1.8 91.56,26.79 v93.34,27.94 93.34,29.48 R2.2
  Top 0.305: 92.71,13.97 JP1.2 | U2.2 82.87,8.25 v82.55,8.57
  Top 0.406: C14.1 C17.1 27.49,5.4 U$13.1 36.51,5.4 v36.83,5.08 36.51,4.76 C19.1 C18.1 | R1.1 54.98,10.53 v57.15,12.7 | 82.55,10.16 C20.1 | R2.2 93.4,31.3 C21.1
  Top 1.016: IC1.4 50.62,17.22 C1.A 52.07,17.78 52.07,16.51 53.34,17.78 C6.1 53.34,16.51 v57.15,12.7 59.69,10.16 82.55,10.16 | 82.55,10.16 88.9,10.16 | 88.9,10.16 92.71,13.97 93.34,14.61 93.34,20.95 v95.25,22.86 | 88.9,10.16 88.9,12.7 88.9,13.97 | 82.55,10.16 v82.55,8.57
  Bottom 0.254: v95.25,22.86 93.34,24.77 v93.34,27.94
  Bottom 0.406: v36.83,5.08 49.53,5.08 v57.15,12.7
  Bottom 1.016: v82.55,8.57 80.01,8.57 78.74,7.3 78.74,6.35 77.47,5.08 SV1.2
5V
  Top 0.305: X2.1 42.85,10.49 41.91,11.43
  Top 0.406: 41.91,26.67 41.91,23.65 | 41.91,26.67 39.37,29.21 20.32,29.21 18.73,27.62 15.24,27.62 | JP8.1 JP10.1 3.99,20.32 5.08,20.32 6.35,21.59 6.35,25.4 8.57,27.62 15.24,27.62 | 15.24,27.62 C22.1 | 41.91,26.67 C23.1
  Top 0.508: 41.91,23.65 IC1.3
  Top 0.762: 41.91,11.43 41.27,12.06 41.27,22.55 IC1.3
#BOOTLOADER  (via drill 0.66 pad 1.42)
  Top 0.254: U1.4 93.05,24.79 94.93,26.67 94.93,29.58 R2.1
  Top 0.406: R3.2 37.73,12.33 v37.47,12.06 | v96.52,30.48 95.89,30.21 R2.1
  Bottom 0.406: v37.47,12.06 47.62,12.06 63.5,27.94 72.71,27.94 74.93,30.16 94.93,30.16 v96.52,30.48
AD1  (via drill 0.66 pad 1.42)
  Top 0.254: U1.33 73.68,24.79 73.66,24.77 69.22,24.77 66.04,21.59 | v66.04,20.64 66.04,21.59 | 66.04,21.59 CIN1.1
  Bottom 0.254: SV1.9 v66.04,20.64
AD2  (via drill 0.66 pad 1.42)
  Top 0.254: U1.34 70,24.29 67.31,21.59 v67.31,19.05 67.31,18.1 66.99,17.78 65.72,17.78 63.82,19.68 CIN3.1
  Bottom 0.254: SV1.10 67.31,6.35 v67.31,19.05
AD3  (via drill 0.66 pad 1.42)
  Top 0.254: U1.35 70.78,23.79 68.58,21.59 v68.58,20.95 68.58,18.1 66.99,16.51 65.41,16.51 61.59,20.32 CIN4.1
  Bottom 0.254: SV1.7 v68.58,20.95
AD4  (via drill 0.66 pad 1.42)
  Top 0.254: U1.40 84.79,18.75 83.19,17.14 80.33,17.14 79.38,18.1 76.83,18.1 75.88,17.14 v69.85,17.14 68.58,15.88 64.77,15.88 59.69,20.95 CIN5.1
  Bottom 0.254: SV1.8 69.85,6.35 v69.85,17.14
ARM_RX  (via drill 0.66 pad 1.42)
  Top 0.254: U1.46 87.79,18.57 88.9,17.46 v90.17,17.46
  Top 0.406: U$13.2 35.34,7.4 v35.56,7.62
  Bottom 0.406: v35.56,7.62 48.26,7.62 64.77,24.13 82.55,24.13 89.22,17.46 v90.17,17.46
ARM_TX  (via drill 0.66 pad 1.42)
  Top 0.254: U1.47 88.29,19.66 88.9,19.05 v91.44,19.05
  Top 0.406: U$13.3 36.7,9.4 v36.83,9.53
  Bottom 0.406: v36.83,9.53 47.62,9.53 63.5,25.4 82.55,25.4 88.9,19.05 v91.44,19.05
BLU_DIM
  Top 0.254: U1.27 80.17,27.79 79.38,28.57 79.38,34.29 78.74,34.92 64.45,34.92
  Top 0.305: RED_LM2.2 64.78,42.24 63.82,41.27
  Top 0.406: 64.45,34.92 63.82,35.56 63.82,41.27
DIO3
  Top 0.406: R3.1 35.88,14.02 35.88,14.61 35.24,15.24 32.7,15.24 30.48,17.46 16.19,17.46 15.24,16.51 15.24,13.34 13.3,11.4 U$13.17
DIO11
  Top 0.406: U$13.7 35.04,17.4 R5.2
EXTRADIGITAL  (via drill 0.66 pad 1.42)
  Top 0.254: U1.22 84.29,33.49 v84.45,33.66 | v55.88,27.94 54.61,29.21 41.91,29.21 40.64,30.48 19.05,30.48 17.78,29.21 v12.7,29.21
  Bottom 0.254: v84.45,33.66 84.14,33.66 83.19,32.7 63.18,32.7 58.42,27.94 v55.88,27.94 | JP8.2 8.89,11.43 12.7,15.24 v12.7,29.21
EXTRADIGITAL2  (via drill 0.66 pad 1.42)
  Top 0.254: U1.23 83.79,32.09 v81.6,34.29 | R4.1 17.78,31.75
  Top 0.508: v57.78,29.84 56.52,29.84 55.88,30.48 42.55,30.48 41.27,31.75 17.78,31.75
  Bottom 0.254: 62.23,34.29 v81.6,34.29
  Bottom 0.508: v57.78,29.84 62.23,34.29
GND  (via drill 0.66 pad 1.42)  (100 unrouted)
  Top 0.254: 81.92,21.91 83.82,23.81 85.09,23.81 85.29,23.61 U1.41 85.29,17.98 83.19,15.88 79.06,15.88 v78.11,16.83 | U1.5 86.79,25.29 86.04,26.04 90.81,30.8 | RED_LM2.7 69.86,42.24 RED_LM2.PAD
  Top 0.305: RED_LM4.PAD 13.34,41.91 13.65,42.23 14.8,42.23 | 14.8,42.23 14.92,42.23 | 14.8,42.23 RED_LM4.7 | RED_LM3407.PAD 32.38,41.91 32.72,42.24 RED_LM3407.7 | RED_LM1.PAD 51.44,41.91 51.75,42.23 52.87,42.23 RED_LM1.7 | RED_LM3.PAD 89.53,41.91 89.85,42.23 90.97,42.23 RED_LM3.7 | U2.3 83.82,2.54 | X2.5 46.05,10.49 46.99,11.43
  Top 0.508: 21.27,33.66 23.81,33.66 24.45,33.02 41.91,33.02 43.18,31.75 59.69,31.75 60.64,30.8 65.41,30.8
  Bottom 0.254: v78.11,16.83 78.11,17.46
  other vias: 31.11,37.47 12.06,37.47 22.86,36.83 41.91,36.83 60.96,36.83 80.01,36.83 99.06,36.83 78.74,21.91 49.53,26.67 68.58,30.48 63.5,27.94 59.69,7.62 59.69,3.81 45.72,13.97 25.4,13.97 21.59,11.43 24.13,24.13 50.16,37.47 69.22,37.47 88.27,37.47 43.18,13.97 60.96,15.24 87.63,47.62 68.58,47.62 49.53,47.62 30.48,47.62 11.43,47.62 22.86,21.59 17.78,21.59 33.02,25.4
  pour Top (isolate 0.813, rank 6): 0,0 0,63.5 101.6,63.5 101.6,0
  pour Bottom (isolate 0.813, rank 6): 0,0 0,63.5 101.6,63.5 101.6,0
GRN_DIM
  Top 0.254: U1.28 79.08,27.29 78.42,27.94 78.42,33.34 77.79,33.97 63.82,33.97
  Top 0.305: RED_LM1.2 45.73,42.24 44.77,41.27
  Top 0.406: 63.82,33.97 62.87,34.92 45.4,34.92 44.77,35.56 44.77,41.27
N$1
  Top 0.305: RED_LM1.6 55.1,41.58 C5.1
N$2
  pour Top: 48.9,40.96 48.9,39.69 47.62,38.42 45.72,38.42 45.4,38.73 45.4,40.32 46.04,40.96
N$3
  Top 0.305: RED_LM3407.6 36.05,41.58 C2.1
N$4
  pour Top: 48.9,42.86 48.9,44.13 47.62,45.4 45.72,45.4 45.4,45.09 45.4,43.5 46.04,42.86
N$5
  pour Top: 29.84,40.96 29.84,39.69 28.57,38.42 26.67,38.42 26.35,38.73 26.35,40.32 26.99,40.96
N$6
  pour Top: 29.84,42.86 29.84,44.13 28.57,45.4 26.67,45.4 26.35,45.09 26.35,43.5 26.99,42.86
N$7
  pour Top (isolate 0.508): 33.34,42.86 34.61,42.86 35.24,43.5 35.24,44.77 35.88,45.4 41.27,45.4 42.55,46.67 42.55,48.26 41.59,49.21 35.56,49.21 33.66,51.12 33.66,53.02 31.11,53.02 31.11,50.8 33.34,48.58
N$8
  pour Top (isolate 0.508): 52.39,42.86 53.66,42.86 54.29,43.5 54.29,44.77 54.93,45.4 60.33,45.4 61.59,46.67 61.59,48.26 60.64,49.21 54.61,49.21 52.7,51.12 52.7,53.02 50.16,53.02 50.16,50.8 52.39,48.58
N$9  (2 unrouted)
N$10
  Top 0.914: C8.2 56.01,59.56 RGBV-.P2
  pour Top (isolate 0.61, rank 2): 54.61,56.52 54.61,51.75 56.2,50.16 60.01,50.16 61.59,51.75 61.59,54.61 59.69,56.52
N$11
  Top 0.305: RED_LM2.6 74.15,41.58 C9.1
N$12
  pour Top: 67.94,40.96 67.94,39.69 66.67,38.42 64.77,38.42 64.45,38.73 64.45,40.32 65.09,40.96
N$13
  pour Top: 67.94,42.86 67.94,44.13 66.67,45.4 64.77,45.4 64.45,45.09 64.45,43.5 65.09,42.86
N$14
  pour Top (isolate 0.508): 71.44,42.86 72.71,42.86 73.34,43.5 73.34,44.77 73.98,45.4 79.38,45.4 80.64,46.67 80.64,48.26 79.69,49.21 73.66,49.21 71.75,51.12 71.75,53.02 69.22,53.02 69.22,50.8 71.44,48.58
N$15
  pour Top (isolate 0.61, rank 2): 73.66,56.52 73.66,51.75 75.25,50.16 79.06,50.16 80.64,51.75 80.64,54.61 78.74,56.52
  pour Top (isolate 0.61, rank 2): 73.98,54.61 73.98,57.15 73.66,57.47 58.1,57.47 57.47,58.1 57.47,60.96 57.78,61.28 59.37,61.28 59.69,60.96 61.59,59.05 76.2,59.05 78.74,56.52 78.74,54.61
N$16
  Top 0.305: RED_LM3.6 93.2,41.58 C13.1
N$17
  pour Top: 87,40.96 87,39.69 85.72,38.42 83.82,38.42 83.5,38.73 83.5,40.32 84.14,40.96
N$18
  pour Top: 87,42.86 87,44.13 85.72,45.4 83.82,45.4 83.5,45.09 83.5,43.5 84.14,42.86
N$19
  pour Top (isolate 0.508): 90.49,42.86 91.76,42.86 92.39,43.5 92.39,44.77 93.03,45.4 98.42,45.4 99.69,46.67 99.69,48.26 98.74,49.21 92.71,49.21 90.81,51.12 90.81,53.02 88.27,53.02 88.27,50.8 90.49,48.58
N$20
  pour Top (isolate 0.61, rank 2): 92.71,56.52 92.71,51.75 94.3,50.16 98.11,50.16 99.69,51.75 99.69,54.61 97.79,56.52
  pour Top (isolate 0.508): 92.71,55.56 92.71,56.83 92.39,57.15 91.44,57.15 90.17,58.42 90.17,61.91 90.49,62.23 95.25,62.23 96.52,60.96 96.52,57.78 97.79,56.52 97.79,55.56
N$21
  Top 0.305: JP1.1 JP7.8
N$23
  Top 0.254: U1.13 88.79,34.18 88.9,34.29 LED2.A
N$24
  Top 0.254: LED2.C 92.56,35.66 R9.1
N$25  (2 unrouted)
N$26
  Top 0.305: RED_LM4.6 17,41.58 CVCC.1
N$27
  pour Top: 10.79,40.96 10.79,39.69 9.53,38.42 7.62,38.42 7.3,38.73 7.3,40.32 7.94,40.96
N$28
  pour Top: 10.79,42.86 10.79,44.13 9.53,45.4 7.62,45.4 7.3,45.09 7.3,43.5 7.94,42.86
N$29
  pour Top (isolate 0.508): 14.29,42.86 15.56,42.86 16.19,43.5 16.19,44.77 16.83,45.4 22.23,45.4 23.5,46.67 23.5,48.26 22.54,49.21 16.51,49.21 14.61,51.12 14.61,53.02 12.06,53.02 12.06,50.8 14.29,48.58
N$30  (2 unrouted)
N$31
  Top 0.254: R4.2 12.7,31.75 11.43,30.48 11.43,30.53 Q1.1
N$32  (2 unrouted)
N$36
  pour Top (isolate 0.61, rank 2): 35.56,56.52 35.56,51.75 37.15,50.16 40.96,50.16 42.55,51.75 42.55,54.61 40.64,56.52
  pour Top (isolate 0.61, rank 2): 54.29,57.78 54.29,61.28 52.7,61.28 50.48,59.05 43.18,59.05 40.64,56.52 40.64,54.61 42.55,54.61 43.81,54.61 45.72,56.52 50.16,56.52 51.44,57.78
N$39
  Top 0.254: -7.62,52.07 -3.81,52.07 | -3.81,52.07 -3.81,54.61 | -3.81,52.07 -3.81,49.53
N$40
  Bottom 0.254: -7.62,52.07 -3.81,52.07 | -3.81,52.07 -3.81,49.53 | -3.81,52.07 -3.81,54.61
N$42
  Top 0.254: -7.62,10.16 -3.81,10.16 | -3.81,10.16 -3.81,12.7 | -3.81,10.16 -3.81,7.62
N$43
  Bottom 0.254: -7.62,10.16 -3.81,10.16 | -3.81,10.16 -3.81,7.62 | -3.81,10.16 -3.81,12.7
N$44
  Top 0.254: 8.89,-7.62 8.89,-3.81 | 8.89,-3.81 6.35,-3.81 | 8.89,-3.81 11.43,-3.81
N$45
  Bottom 0.254: 8.89,-7.62 8.89,-3.81 | 8.89,-3.81 11.43,-3.81 | 8.89,-3.81 6.35,-3.81
N$46
  Top 0.254: 36.83,-7.62 36.83,-3.81 | 36.83,-3.81 34.29,-3.81 | 36.83,-3.81 39.37,-3.81
N$47
  Bottom 0.254: 36.83,-7.62 36.83,-3.81 | 36.83,-3.81 39.37,-3.81 | 36.83,-3.81 34.29,-3.81
N$48
  Top 0.254: 64.77,-7.62 64.77,-3.81 | 64.77,-3.81 62.23,-3.81 | 64.77,-3.81 67.31,-3.81
N$49
  Bottom 0.254: 64.77,-7.62 64.77,-3.81 | 64.77,-3.81 67.31,-3.81 | 64.77,-3.81 62.23,-3.81
N$50
  Top 0.254: 90.17,-7.62 90.17,-3.81 | 90.17,-3.81 87.63,-3.81 | 90.17,-3.81 92.71,-3.81
N$51
  Bottom 0.254: 90.17,-7.62 90.17,-3.81 | 90.17,-3.81 92.71,-3.81 | 90.17,-3.81 87.63,-3.81
N$52
  Top 0.254: 105.41,8.89 109.22,8.89 | 105.41,6.35 105.41,8.89 | 105.41,8.89 105.41,11.43
N$53
  Bottom 0.254: 105.41,8.89 109.22,8.89 | 105.41,8.89 105.41,11.43 | 105.41,6.35 105.41,8.89
N$54
  Top 0.254: 105.41,40.64 109.22,40.64 | 105.41,38.1 105.41,40.64 | 105.41,40.64 105.41,43.18
N$55
  Bottom 0.254: 105.41,40.64 109.22,40.64 | 105.41,40.64 105.41,43.18 | 105.41,38.1 105.41,40.64
N$56
  Top 0.254: 91.44,66.04 91.44,69.85 | 91.44,66.04 93.98,66.04 | 88.9,66.04 91.44,66.04
N$57
  Bottom 0.254: 91.44,66.04 91.44,69.85 | 88.9,66.04 91.44,66.04 | 91.44,66.04 93.98,66.04
N$58
  Top 0.254: 63.5,66.04 63.5,69.85 | 63.5,66.04 66.04,66.04 | 60.96,66.04 63.5,66.04
N$59
  Bottom 0.254: 63.5,66.04 63.5,69.85 | 60.96,66.04 63.5,66.04 | 63.5,66.04 66.04,66.04
N$60
  Top 0.254: 35.56,66.04 35.56,69.85 | 35.56,66.04 38.1,66.04 | 33.02,66.04 35.56,66.04
N$61
  Bottom 0.254: 35.56,66.04 35.56,69.85 | 33.02,66.04 35.56,66.04 | 35.56,66.04 38.1,66.04
N$62
  Top 0.254: 10.16,66.04 10.16,69.85 | 10.16,66.04 12.7,66.04 | 7.62,66.04 10.16,66.04
N$63
  Bottom 0.254: 10.16,66.04 10.16,69.85 | 7.62,66.04 10.16,66.04 | 10.16,66.04 12.7,66.04
N$64
  Top 0.406: Q1.3 9.06,29.38 5.08,25.4 5.08,25.26 JP10.2
N$322
  Top 0.305: U$11.2A 21.58,51.63 | U$11.2B 18,54.2 COUT.2 17.59,55.75 17.78,55.88
  pour Top (isolate 0.61, rank 2): 16.51,56.52 16.51,51.75 18.1,50.16 21.91,50.16 23.5,51.75 23.5,54.61 21.59,56.52
  pour Top (isolate 0.508, rank 2): 16.51,55.56 16.51,56.83 16.19,57.15 15.24,57.15 13.97,58.42 13.97,61.91 14.29,62.23 19.05,62.23 20.32,60.96 20.32,57.78 21.59,56.52 21.59,55.56
PWR_LED_R
  Top 0.406: LED1.A 56.93,8.74 R1.2
RED_DIM
  Top 0.254: U1.30 76.27,26.29 74.93,27.62 74.93,32.38 74.3,33.02 62.87,33.02
  Top 0.305: RED_LM3407.2 26.68,42.24 25.72,41.27
  Top 0.406: 62.87,33.02 61.91,33.97 44.45,33.97 43.5,34.92 26.35,34.92 25.72,35.56 25.72,41.27
RESET  (via drill 0.66 pad 1.42)
  Top 0.254: U1.3 94.14,24.29 v96.52,24.45 JP7.3 | S1.4 S1.3 95.29,7.34 v96.84,8.89
  Top 0.305: S1.4 85.13,7.34 84.77,6.99 U2.1
  Top 0.406: R5.1 37.73,18.15 v37.47,18.41
  Bottom 0.254: v96.84,8.89 96.84,23.81 v96.52,24.45
  Bottom 0.406: 39.37,18.41 v37.47,18.41 36.2,18.41 34.29,16.51 34.29,5.08 35.56,3.81 52.07,3.81 54.61,1.27 81.56,1.27 87.63,7.34 S1.4
RSSI
  Top 0.406: U$13.6 27.78,15.4 26.67,16.51 17.78,16.51 16.51,15.24 16.51,4.82 R6.2
RSSI_R
  Top 0.406: R6.1 14.34,2.37 LED3.A
SW1  (via drill 0.66 pad 1.42)
  Top 0.254: U1.38 83.79,20.29 83.19,19.68 75.25,19.68 v74.61,19.05
  Bottom 0.254: SV1.3 73.66,18.1 v74.61,19.05
SW2  (via drill 0.66 pad 1.42)
  Top 0.254: U1.36 72.81,23.29 71.12,21.59 v71.12,20.95
  Bottom 0.254: SV1.5 v71.12,20.95
SW3  (via drill 0.66 pad 1.42)
  Top 0.254: U1.37 83.29,21.06 82.55,20.32 73.34,20.32 72.39,19.37 v72.39,19.05
  Bottom 0.254: SV1.6 72.39,6.35 v72.39,19.05
SW4  (via drill 0.66 pad 1.42)
  Top 0.305: U1.43 86.29,15.81 v85.09,14.61
  Bottom 0.254: SV1.1 76.2,13.65
  Bottom 0.305: v85.09,14.61 77.15,14.61 76.2,13.65
SWCLK  (via drill 0.66 pad 1.42)
  Top 0.254: U1.29 77.99,26.79 v76.83,27.94
  Top 1.016: v95.25,16.51 JP7.6
  Bottom 1.016: v76.83,27.94 86.36,27.94 95.25,19.05 v95.25,16.51
SWDIO  (via drill 0.66 pad 1.42)
  Top 0.254: U1.39 84.29,19.52 83.5,18.73 81.6,18.73 v81.28,18.41
  Top 1.016: v95.25,13.97 JP7.7
  Bottom 0.254: v95.25,13.97 93.98,15.24 90.17,15.24 87,18.41 v81.28,18.41
VHI  (via drill 0.66 pad 1.42)
  Top 0.305: RED_LM4.5 17.05,40.92 CIN2.1 | C12.1 71.75,55.56 70.48,54.29 67.31,54.29 66.04,53.02 66.04,52.14 D3.C | RED_LM1.5 55.15,40.92 C7.1
  Top 0.914: D5.C 8.89,52.14
  Bottom 1.905: v25.4,52.07 34.29,52.07 v34.29,38.1 | v53.34,38.1 53.34,52.07 v44.45,52.07 | v63.5,52.07 72.39,52.07 v72.39,38.1 | v82.55,52.07 87.63,52.07 91.44,48.26 v91.44,38.1 | v15.24,38.1 15.24,52.07 v6.35,52.07
  pour Top (isolate 0.61, rank 3): 54.29,53.98 48.58,53.98 48.26,53.66 48.26,50.8 47.94,50.48 43.5,50.48 43.18,50.8 43.18,52.7 45.4,54.93 46.04,55.56 50.16,55.56 51.12,56.52 54.29,56.52
  pour Top (isolate 0.61, rank 3): 73.34,53.98 67.63,53.98 67.31,53.66 67.31,50.8 66.99,50.48 62.55,50.48 62.23,50.8 62.23,52.7 64.45,54.93 65.09,55.56 69.22,55.56 70.17,56.52 73.34,56.52
  pour Top (isolate 0.61, rank 3): 35.24,53.98 29.53,53.98 29.21,53.66 29.21,50.8 28.89,50.48 24.45,50.48 24.13,50.8 24.13,52.7 26.35,54.93 26.99,55.56 31.11,55.56 32.07,56.52 35.24,56.52
  pour Top (isolate 0.61, rank 3): 16.19,53.98 10.48,53.98 10.16,53.66 10.16,50.8 9.84,50.48 5.4,50.48 5.08,50.8 5.08,52.7 7.94,55.56 12.06,55.56 13.02,56.52 16.19,56.52
  pour Top (isolate 0.508): 33.02,41.27 38.73,41.27 38.73,38.1 38.42,37.78 36.51,37.78 35.56,36.83 33.02,36.83
  pour Top (isolate 0.508): 71.12,41.27 76.83,41.27 76.83,38.1 76.52,37.78 74.61,37.78 73.66,36.83 71.12,36.83
  pour Top (isolate 0.61, rank 3): 92.39,53.98 86.68,53.98 86.36,53.66 86.36,50.8 86.04,50.48 81.6,50.48 81.28,50.8 81.28,52.7 83.5,54.93 84.14,55.56 88.27,55.56 89.22,56.52 92.39,56.52
  pour Top (isolate 0.508): 90.17,41.27 95.89,41.27 95.89,38.1 95.57,37.78 93.66,37.78 92.71,36.83 90.17,36.83
  pour Top (isolate 0.508): 52.07,41.27 57.78,41.27 57.78,38.1 57.47,37.78 55.56,37.78 54.61,36.83 52.07,36.83
  pour Bottom (isolate 0.813): 0,30.48 5.08,30.48 6.35,31.75 6.35,46.99 8.89,49.53 100.33,49.53 100.33,62.23 7.62,62.23 0,54.61
  pour Top (isolate 0.508): 13.97,41.27 19.68,41.27 19.68,38.1 19.37,37.78 17.46,37.78 16.51,36.83 13.97,36.83
WW2_DIM
  Top 0.254: U1.32 76,25.29 73.66,27.62 73.66,31.43 73.03,32.07 61.59,32.07
  Top 0.305: RED_LM4.2 7.63,42.24 6.67,41.27
  Top 0.406: 61.59,32.07 60.64,33.02 43.5,33.02 42.55,33.97 25.4,33.97 24.45,34.92 7.3,34.92 6.67,35.56 6.67,41.27
WW_DIM
  Top 0.254: U1.17 86.79,34.49 86.36,34.92 83.5,34.92
  Top 0.305: 82.87,41.27 83.82,42.23 86.17,42.23 RED_LM3.2
  Top 0.406: 83.5,34.92 82.87,35.56 82.87,41.27

### Text on the board
Milling: <-RGB | STV-> | <-BLW | RGB-> | PWR | RST
tDocu: BIG CAP